# EAGLE design 2021-07-02 OrangeHat (EAGLE 8.6.3)
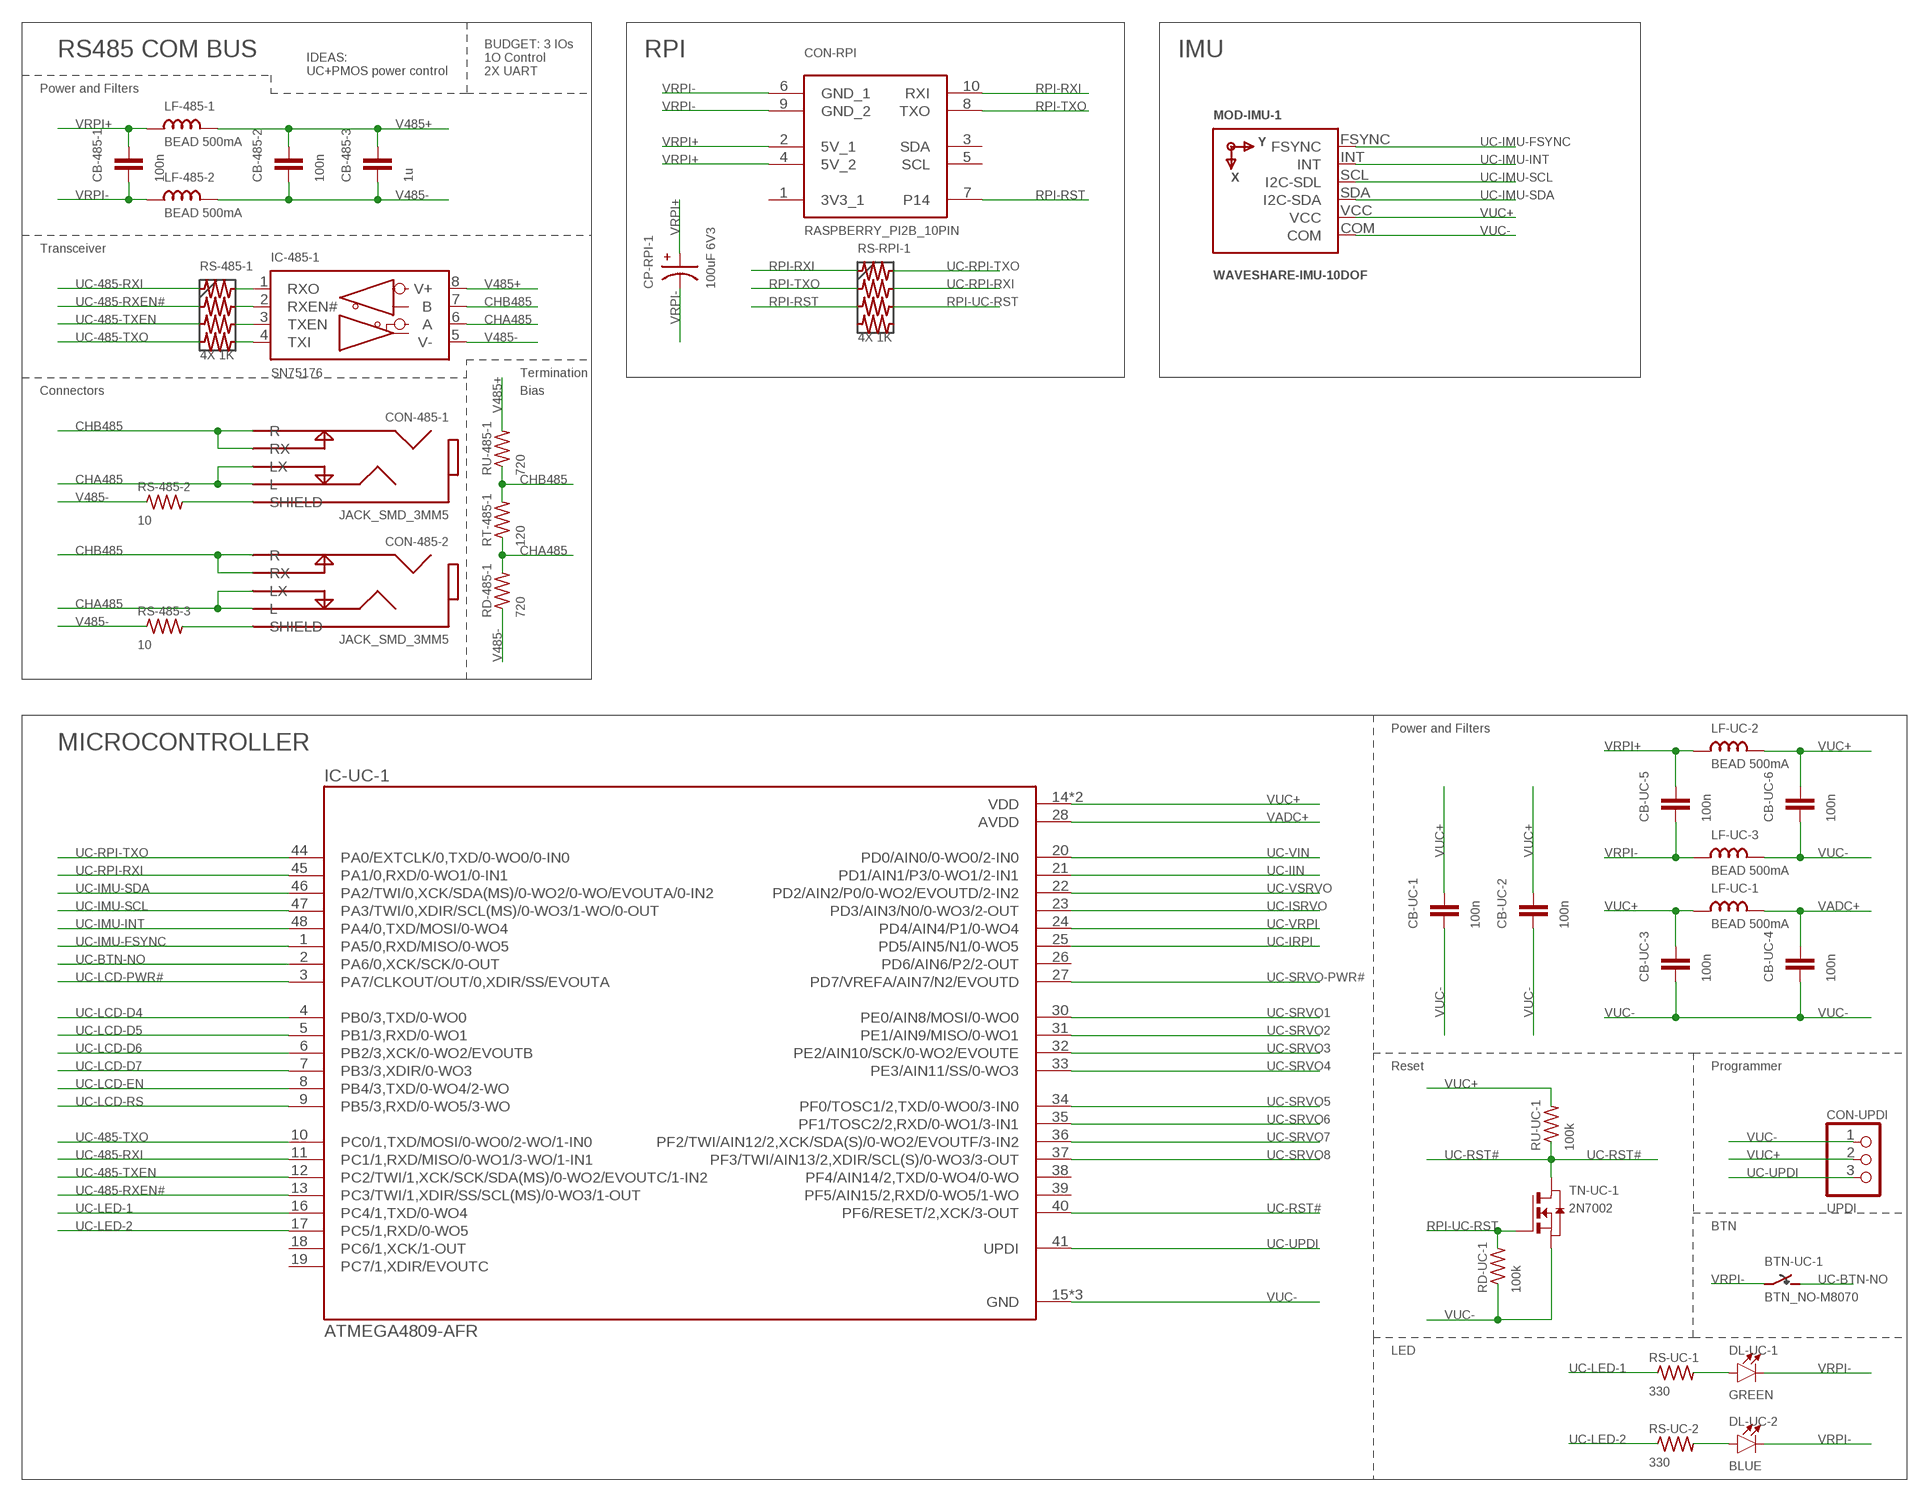
[diagram p0: schematic, sheet 1, part 1 of 2]
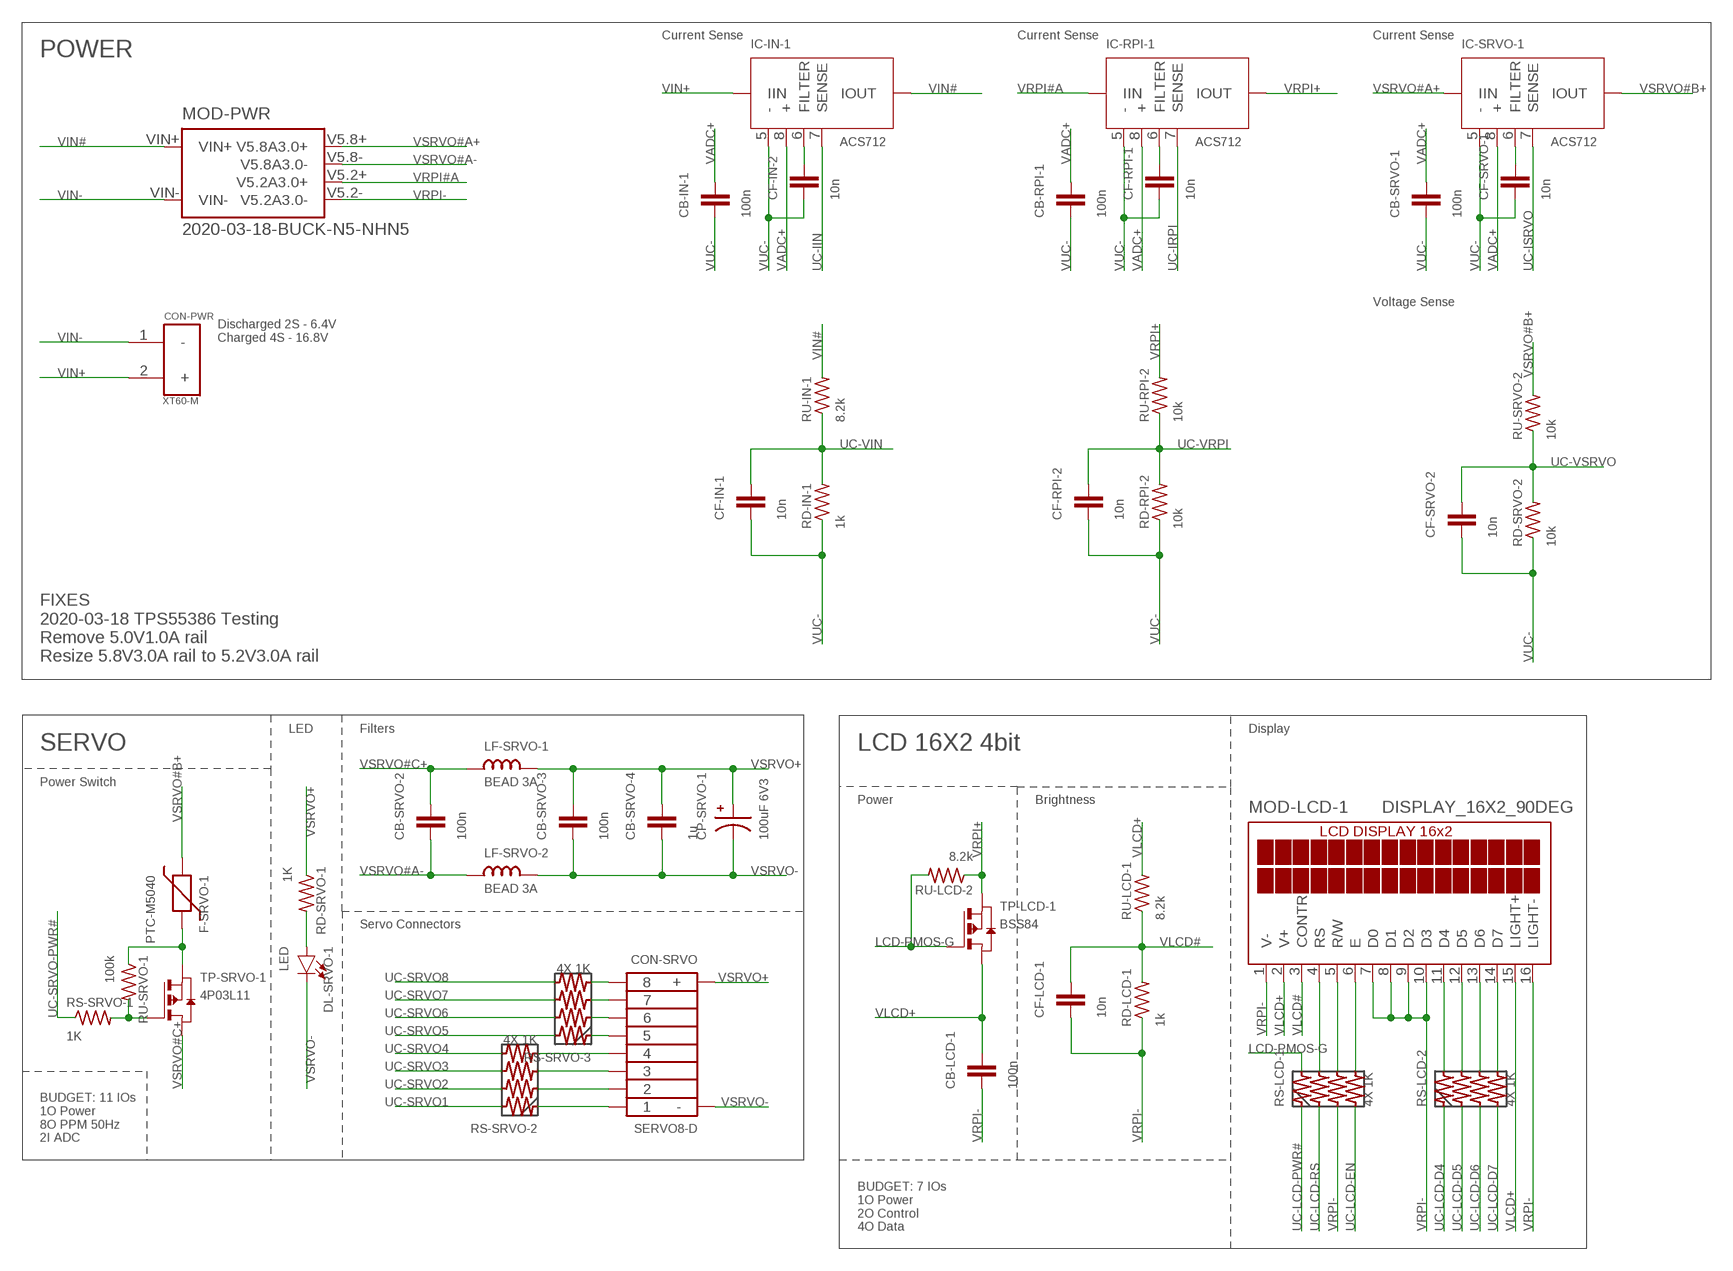
[diagram p1: schematic, sheet 1, part 2 of 2]

## Parts
BTN-UC-1  BTN_NO-M8070  [SMD_BTN_M8070]
CB-485-1  100n  C-NPOL  [SMD-M2012]
CB-485-2  100n  C-NPOL  [SMD-M2012]
CB-485-3  1u  C-NPOL  [SMD-M2012]
CB-IN-1  100n  C-NPOL  [SMD-M2012]
CB-LCD-1  100n  C-NPOL  [SMD-M2012]
CB-RPI-1  100n  C-NPOL  [SMD-M2012]
CB-SRVO-1  100n  C-NPOL  [SMD-M2012]
CB-SRVO-2  100n  C-NPOL  [SMD-M2012]
CB-SRVO-3  100n  C-NPOL  [SMD-M2012]
CB-SRVO-4  1u  C-NPOL  [SMD-M2012]
CB-UC-1  100n  C-NPOL  [SMD-M2012]
CB-UC-2  100n  C-NPOL  [SMD-M2012]
CB-UC-3  100n  C-NPOL  [SMD-M2012]
CB-UC-4  100n  C-NPOL  [SMD-M2012]
CB-UC-5  100n  C-NPOL  [SMD-M2012]
CB-UC-6  100n  C-NPOL  [SMD-M2012]
CF-IN-1  10n  C-NPOL  [SMD-M2012]
CF-IN-2  10n  C-NPOL  [SMD-M2012]
CF-LCD-1  10n  C-NPOL  [SMD-M2012]
CF-RPI-1  10n  C-NPOL  [SMD-M2012]
CF-RPI-2  10n  C-NPOL  [SMD-M2012]
CF-SRVO-1  10n  C-NPOL  [SMD-M2012]
CF-SRVO-2  10n  C-NPOL  [SMD-M2012]
CON-485-1  JACK_SMD_3MM5  [JACK_SMD_3MM5]
CON-485-2  JACK_SMD_3MM5  [JACK_SMD_3MM5]
CON-PWR  XT60-M  [AMASS_XT60-M]
CON-RPI  RASPBERRY_PI2B_10PIN  [RASPBERRY_PI2B_10PIN]
CON-SRVO  SERVO8-D  [SERVO8#]
CON-UPDI  UPDI  PINHD-1X3  [1X03]
CP-RPI-1  100uF 6V3  C-POLE2.5-5  [E2,5-5]
CP-SRVO-1  100uF 6V3  C-POLE2.5-5  [E2,5-5]
DL-SRVO-1  LED  [SMD-M2012-POL]
DL-UC-1  GREEN  LED  [SMD-M2012-POL]
DL-UC-2  BLUE  LED  [SMD-M2012-POL]
F-SRVO-1  PTC-M5040  [SMD-M5040]
IC-485-1  SN75176  RS485  [DIL08]
IC-IN-1  ACS712  [SO8]
IC-RPI-1  ACS712  [SO8]
IC-SRVO-1  ACS712  [SO8]
IC-UC-1  ATMEGA4809-AFR  [QFP50P900X900X120-48N]
LF-485-1  BEAD 500mA  L-M2012  [SMD-M2012]
LF-485-2  BEAD 500mA  L-M2012  [SMD-M2012]
LF-SRVO-1  BEAD 3A  L-M2016  [SMD-M2016]
LF-SRVO-2  BEAD 3A  L-M2016  [SMD-M2016]
LF-UC-1  BEAD 500mA  L-M2012  [SMD-M2012]
LF-UC-2  BEAD 500mA  L-M2012  [SMD-M2012]
LF-UC-3  BEAD 500mA  L-M2012  [SMD-M2012]
MOD-IMU-1  WAVESHARE-IMU-10DOF  [WAVESHARE-IMU-10DOF]
MOD-LCD-1  DISPLAY_16X2_90DEG  [DISPLAY_16X2_90DEG]
MOD-PWR  2020-03-18-BUCK-N5-NHN5  [2020-03-18-BUCK-NHN5]
RD-485-1  720  R0207/2V  [TH-2MM54-V]
RD-IN-1  1k  R-M2012  [SMD-M2012]
RD-LCD-1  1k  R-M2012  [SMD-M2012]
RD-RPI-2  10k  R-M2012  [SMD-M2012]
RD-SRVO-1  1K  R-M2012  [SMD-M2012]
RD-SRVO-2  10k  R-M2012  [SMD-M2012]
RD-UC-1  100k  R-M2012  [SMD-M2012]
RS-485-1  4X 1K  RAC164  [RAC1206]
RS-485-2  10  R-M2012  [SMD-M2012]
RS-485-3  10  R-M2012  [SMD-M2012]
RS-LCD-1  4X 1K  RAC164  [RAC1206]
RS-LCD-2  4X 1K  RAC164  [RAC1206]
RS-RPI-1  4X 1K  RAC164  [RAC1206]
RS-SRVO-1  1K  R-M2012  [SMD-M2012]
RS-SRVO-2  4X 1K  RAC164  [RAC1206]
RS-SRVO-3  4X 1K  RAC164  [RAC1206]
RS-UC-1  330  R-M2012  [SMD-M2012]
RS-UC-2  330  R-M2012  [SMD-M2012]
RT-485-1  120  R0207/2V  [TH-2MM54-V]
RU-485-1  720  R0207/2V  [TH-2MM54-V]
RU-IN-1  8.2k  R-M2012  [SMD-M2012]
RU-LCD-1  8.2k  R-M2012  [SMD-M2012]
RU-LCD-2  8.2k  R-M2012  [SMD-M2012]
RU-RPI-2  10k  R-M2012  [SMD-M2012]
RU-SRVO-1  100k  R-M2012  [SMD-M2012]
RU-SRVO-2  10k  R-M2012  [SMD-M2012]
RU-UC-1  100k  R-M2012  [SMD-M2012]
TN-UC-1  2N7002  MOS-N-SOT23  [SOT23]
TP-LCD-1  BSS84  MOS-P-SOT23  [SOT23]
TP-SRVO-1  4P03L11  MOS-P-TO252  [TO252]

## Nets
CHA485: CON-485-1.L CON-485-1.LX CON-485-2.L CON-485-2.LX IC-485-1.6(A) RD-485-1.2 RT-485-1.1
CHB485: CON-485-1.R CON-485-1.RX CON-485-2.R CON-485-2.RX IC-485-1.7(B) RT-485-1.2 RU-485-1.1
LCD-PMOS-G: RS-LCD-1.1B RU-LCD-2.2 TP-LCD-1.1(G)
N$1: CF-RPI-1.2 IC-RPI-1.6(FILTER)
N$2 [Supply]: CF-IN-2.2 IC-IN-1.6(FILTER)
N$3: MOD-LCD-1.5(R/W) RS-LCD-1.3B
N$4: DL-UC-1.+ RS-UC-1.2
N$5: RS-SRVO-1.2 RU-SRVO-1.2 TP-SRVO-1.1(G)
N$6: F-SRVO-1.2 RU-SRVO-1.1 TP-SRVO-1.2(S)
N$7: MOD-LCD-1.4(RS) RS-LCD-1.2B
N$9: MOD-LCD-1.6(E) RS-LCD-1.4B
N$10: MOD-LCD-1.11(D4) RS-LCD-2.1B
N$11: MOD-LCD-1.12(D5) RS-LCD-2.2B
N$12: MOD-LCD-1.13(D6) RS-LCD-2.3B
N$13: MOD-LCD-1.14(D7) RS-LCD-2.4B
N$15: DL-UC-2.+ RS-UC-2.2
N$19: IC-485-1.1(RXO) RS-485-1.1B
N$20: IC-485-1.2(RXEN#) RS-485-1.2B
N$21: CF-SRVO-1.2 IC-SRVO-1.6(FILTER)
N$22: DL-SRVO-1.+ RD-SRVO-1.2
N$23: CON-SRVO.8 RS-SRVO-3.4A
N$24: CON-SRVO.7 RS-SRVO-3.3A
N$25: CON-SRVO.6 RS-SRVO-3.2A
N$26: CON-SRVO.5 RS-SRVO-3.1A
N$27: CON-SRVO.4 RS-SRVO-2.4A
N$28: CON-SRVO.3 RS-SRVO-2.3A
N$29: CON-SRVO.2 RS-SRVO-2.2A
N$30: CON-SRVO.1 RS-SRVO-2.1A
N$44: IC-485-1.3(TXEN) RS-485-1.3B
N$45: IC-485-1.4(TXI) RS-485-1.4B
N$46: CON-485-1.SHIELD RS-485-2.2
N$47: CON-485-2.SHIELD RS-485-3.2
RPI-RST: CON-RPI.7(P14) RS-RPI-1.3A
RPI-RXI: CON-RPI.10(RXI) RS-RPI-1.1A
RPI-TXO: CON-RPI.8(TXO) RS-RPI-1.2A
RPI-UC-RST: RD-UC-1.2 RS-RPI-1.3B TN-UC-1.1(G)
UC-485-RXEN#: IC-UC-1.13(PC3/TWI/1,XDIR/SS/SCL(MS)/0-WO3/1-OUT) RS-485-1.2A
UC-485-RXI: IC-UC-1.11(PC1/1,RXD/MISO/0-WO1/3-WO/1-IN1) RS-485-1.1A
UC-485-TXEN: IC-UC-1.12(PC2/TWI/1,XCK/SCK/SDA(MS)/0-WO2/EVOUTC/1-IN2) RS-485-1.3A
UC-485-TXO: IC-UC-1.10(PC0/1,TXD/MOSI/0-WO0/2-WO/1-IN0) RS-485-1.4A
UC-BTN-NO: BTN-UC-1.2B BTN-UC-1.3B IC-UC-1.2(PA6/0,XCK/SCK/0-OUT)
UC-IIN: IC-IN-1.7(SENSE) IC-UC-1.21(PD1/AIN1/P3/0-WO1/2-IN1)
UC-IMU-FSYNC: IC-UC-1.1(PA5/0,RXD/MISO/0-WO5) MOD-IMU-1.FSYNC
UC-IMU-INT: IC-UC-1.48(PA4/0,TXD/MOSI/0-WO4) MOD-IMU-1.INT
UC-IMU-SCL: IC-UC-1.47(PA3/TWI/0,XDIR/SCL(MS)/0-WO3/1-WO/0-OUT) MOD-IMU-1.SCL(I2C-SDL)
UC-IMU-SDA: IC-UC-1.46(PA2/TWI/0,XCK/SDA(MS)/0-WO2/0-WO/EVOUTA/0-IN2) MOD-IMU-1.SDA(I2C-SDA)
UC-IRPI: IC-RPI-1.7(SENSE) IC-UC-1.25(PD5/AIN5/N1/0-WO5)
UC-ISRVO: IC-SRVO-1.7(SENSE) IC-UC-1.23(PD3/AIN3/N0/0-WO3/2-OUT)
UC-LCD-D4: IC-UC-1.4(PB0/3,TXD/0-WO0) RS-LCD-2.1A
UC-LCD-D5: IC-UC-1.5(PB1/3,RXD/0-WO1) RS-LCD-2.2A
UC-LCD-D6: IC-UC-1.6(PB2/3,XCK/0-WO2/EVOUTB) RS-LCD-2.3A
UC-LCD-D7: IC-UC-1.7(PB3/3,XDIR/0-WO3) RS-LCD-2.4A
UC-LCD-EN: IC-UC-1.8(PB4/3,TXD/0-WO4/2-WO) RS-LCD-1.4A
UC-LCD-PWR#: IC-UC-1.3(PA7/CLKOUT/OUT/0,XDIR/SS/EVOUTA) RS-LCD-1.1A
UC-LCD-RS: IC-UC-1.9(PB5/3,RXD/0-WO5/3-WO) RS-LCD-1.2A
UC-LED-1: IC-UC-1.16(PC4/1,TXD/0-WO4) RS-UC-1.1
UC-LED-2: IC-UC-1.17(PC5/1,RXD/0-WO5) RS-UC-2.1
UC-RPI-RXI: IC-UC-1.45(PA1/0,RXD/0-WO1/0-IN1) RS-RPI-1.2B
UC-RPI-TXO: IC-UC-1.44(PA0/EXTCLK/0,TXD/0-WO0/0-IN0) RS-RPI-1.1B
UC-RST#: IC-UC-1.40(PF6/RESET/2,XCK/3-OUT) RU-UC-1.1 TN-UC-1.3(D)
UC-SRVO1: IC-UC-1.30(PE0/AIN8/MOSI/0-WO0) RS-SRVO-2.1B
UC-SRVO2: IC-UC-1.31(PE1/AIN9/MISO/0-WO1) RS-SRVO-2.2B
UC-SRVO3: IC-UC-1.32(PE2/AIN10/SCK/0-WO2/EVOUTE) RS-SRVO-2.3B
UC-SRVO4: IC-UC-1.33(PE3/AIN11/SS/0-WO3) RS-SRVO-2.4B
UC-SRVO5: IC-UC-1.34(PF0/TOSC1/2,TXD/0-WO0/3-IN0) RS-SRVO-3.1B
UC-SRVO6: IC-UC-1.35(PF1/TOSC2/2,RXD/0-WO1/3-IN1) RS-SRVO-3.2B
UC-SRVO7: IC-UC-1.36(PF2/TWI/AIN12/2,XCK/SDA(S)/0-WO2/EVOUTF/3-IN2) RS-SRVO-3.3B
UC-SRVO8: IC-UC-1.37(PF3/TWI/AIN13/2,XDIR/SCL(S)/0-WO3/3-OUT) RS-SRVO-3.4B
UC-SRVO-PWR#: IC-UC-1.27(PD7/VREFA/AIN7/N2/EVOUTD) RS-SRVO-1.1
UC-UPDI: CON-UPDI.3 IC-UC-1.41(UPDI)
UC-VIN: CF-IN-1.2 IC-UC-1.20(PD0/AIN0/0-WO0/2-IN0) RD-IN-1.2 RU-IN-1.1
UC-VRPI: CF-RPI-2.2 IC-UC-1.24(PD4/AIN4/P1/0-WO4) RD-RPI-2.2 RU-RPI-2.1
UC-VSRVO: CF-SRVO-2.2 IC-UC-1.22(PD2/AIN2/P0/0-WO2/EVOUTD/2-IN2) RD-SRVO-2.2 RU-SRVO-2.1
V485+ [Supply]: CB-485-2.2 CB-485-3.2 IC-485-1.8(V+) LF-485-1.2 RU-485-1.2
V485- [Supply]: CB-485-2.1 CB-485-3.1 IC-485-1.5(V-) LF-485-2.2 RD-485-1.1 RS-485-2.1 RS-485-3.1
VADC+ [Supply]: CB-IN-1.2 CB-RPI-1.2 CB-SRVO-1.2 CB-UC-4.2 IC-IN-1.8(+) IC-RPI-1.8(+) IC-SRVO-1.8(+) IC-UC-1.28(AVDD) LF-UC-1.2
VIN# [POWER]: IC-IN-1.3(IOUT) IC-IN-1.4(IOUT) MOD-PWR.VIN+ RU-IN-1.2
VIN+ [POWER]: CON-PWR.2(+) IC-IN-1.1(IIN) IC-IN-1.2(IIN)
VIN- [POWER]: CON-PWR.1(-) MOD-PWR.VIN-
VLCD#: CF-LCD-1.2 MOD-LCD-1.3(CONTR) RD-LCD-1.2 RU-LCD-1.1
VLCD+: CB-LCD-1.2 MOD-LCD-1.2(V+) MOD-LCD-1.15(LIGHT+) RU-LCD-1.2 TP-LCD-1.3(D)
VRPI#A: IC-RPI-1.1(IIN) IC-RPI-1.2(IIN) MOD-PWR.V5.2+(V5.2A3.0+)
VRPI+ [POWER]: CB-485-1.2 CB-UC-5.2 CON-RPI.2(5V_1) CON-RPI.4(5V_2) CP-RPI-1.+ IC-RPI-1.3(IOUT) IC-RPI-1.4(IOUT) LF-485-1.1 LF-UC-2.1 RU-LCD-2.1 RU-RPI-2.2 TP-LCD-1.2(S)
VRPI- [POWER]: BTN-UC-1.1A BTN-UC-1.4A CB-485-1.1 CB-LCD-1.1 CB-UC-5.1 CF-LCD-1.1 CON-RPI.6(GND_1) CON-RPI.9(GND_2) CP-RPI-1.- DL-UC-1.- DL-UC-2.- LF-485-2.1 LF-UC-3.1 MOD-LCD-1.1(V-) MOD-LCD-1.7(D0) MOD-LCD-1.8(D1) MOD-LCD-1.9(D2) MOD-LCD-1.10(D3) MOD-LCD-1.16(LIGHT-) MOD-PWR.V5.2-(V5.2A3.0-) RD-LCD-1.1 RS-LCD-1.3A
VSRVO#A+: IC-SRVO-1.1(IIN) IC-SRVO-1.2(IIN) MOD-PWR.V5.8+(V5.8A3.0+)
VSRVO#A- [POWER]: CB-SRVO-2.1 LF-SRVO-2.1 MOD-PWR.V5.8-(V5.8A3.0-)
VSRVO#B+: F-SRVO-1.1 IC-SRVO-1.3(IOUT) IC-SRVO-1.4(IOUT) RU-SRVO-2.2
VSRVO#C+: CB-SRVO-2.2 LF-SRVO-1.1 TP-SRVO-1.3(D)
VSRVO+ [POWER]: CB-SRVO-3.2 CB-SRVO-4.2 CON-SRVO.1+(+) CON-SRVO.2+(+) CON-SRVO.3+(+) CON-SRVO.4+(+) CON-SRVO.5+(+) CON-SRVO.6+(+) CON-SRVO.7+(+) CON-SRVO.8+(+) CP-SRVO-1.+ LF-SRVO-1.2 RD-SRVO-1.1
VSRVO- [POWER]: CB-SRVO-3.1 CB-SRVO-4.1 CON-SRVO.1-(-) CON-SRVO.2-(-) CON-SRVO.3-(-) CON-SRVO.4-(-) CON-SRVO.5-(-) CON-SRVO.6-(-) CON-SRVO.7-(-) CON-SRVO.8-(-) CP-SRVO-1.- DL-SRVO-1.- LF-SRVO-2.2
VUC+ [Supply]: CB-UC-1.2 CB-UC-2.2 CB-UC-3.2 CB-UC-6.2 CON-UPDI.2 IC-UC-1.14(VDD) IC-UC-1.42(VDD) LF-UC-1.1 LF-UC-2.2 MOD-IMU-1.VCC RU-UC-1.2
VUC- [Supply]: CB-IN-1.1 CB-RPI-1.1 CB-SRVO-1.1 CB-UC-1.1 CB-UC-2.1 CB-UC-3.1 CB-UC-4.1 CB-UC-6.1 CF-IN-1.1 CF-IN-2.1 CF-RPI-1.1 CF-RPI-2.1 CF-SRVO-1.1 CF-SRVO-2.1 CON-UPDI.1 IC-IN-1.5(-) IC-RPI-1.5(-) IC-SRVO-1.5(-) IC-UC-1.15(GND) IC-UC-1.29(GND) IC-UC-1.43(GND) LF-UC-3.2 MOD-IMU-1.COM RD-IN-1.1 RD-RPI-2.1 RD-SRVO-2.1 RD-UC-1.1 TN-UC-1.2(S)
Unconnected: CON-RPI.3(SDA) CON-RPI.5(SCL) IC-UC-1.18(PC6/1,XCK/1-OUT) IC-UC-1.19(PC7/1,XDIR/EVOUTC) IC-UC-1.26(PD6/AIN6/P2/2-OUT) IC-UC-1.38(PF4/AIN14/2,TXD/0-WO4/0-WO) IC-UC-1.39(PF5/AIN15/2,RXD/0-WO5/1-WO) RS-RPI-1.4A RS-RPI-1.4B

## Notes on the sheet
- RS485 COM BUS | RPI | IMU
- IDEAS:
  UC+PMOS power control
- BUDGET: 3 IOs
  1O Control
  2X UART
- Power and Filters
- Transceiver
- Termination
- Connectors | Bias
- Power and Filters
- MICROCONTROLLER
- Reset | Programmer
- BTN
- LED
- Current Sense | Current Sense | Current Sense
- POWER
- Voltage Sense
- Discharged 2S - 6.4V
  Charged 4S - 16.8V
- FIXES
  2020-03-18 TPS55386 Testing
  Remove 5.0V1.0A rail
  Resize 5.8V3.0A rail to 5.2V3.0A rail
- LED | Filters | Display
- SERVO | LCD 16X2 4bit
- Power Switch
- Power | Brightness
- Servo Connectors
- BUDGET: 11 IOs
  1O Power
  8O PPM 50Hz
  2I ADC
- BUDGET: 7 IOs
  1O Power
  2O Control
  4O Data

## Power pins joined to a net without a drawn wire
3V3_1: CON-RPI.1(3V3_1)

## Library data of the parts
BTN-UC-1 = 2021-07-02 OrangeHat Library:BTN_NO: Push Button NO (Normally open)
CB-485-1-CB-485-3 CB-IN-1 CB-LCD-1 CB-RPI-1 CB-SRVO-1-CB-SRVO-4 CB-UC-1-CB-UC-6 CF-IN-1 CF-IN-2 CF-LCD-1 CF-RPI-1 CF-RPI-2 CF-SRVO-1 CF-SRVO-2 = 2021-07-02 OrangeHat Library:C-NPOL: CAPACITOR, European symbol
CON-485-1 CON-485-2 = 2021-07-02 OrangeHat Library:JACK_SMD_3MM5: Jack 3.5mm Used to transmit two data channels and 0V reference
CON-PWR = 2021-07-02 OrangeHat Library:XT60-M: DC supply; XT60; male; PIN:2; for cable; soldered; 60A; 500V; AVAILABILITY: Unavailable; MF: AMASS; MP: XT60-M; PACKAGE: Package Analog Devices; PRICE: None
CON-RPI = 2021-07-02 OrangeHat Library:RASPBERRY_PI2B_10PIN: Raspberry Pi 2B/3B Hat Footprint RPI Hat that makes use of 10 pins of the GPIO 2019-10-11: >Updated footprint >Updated GPIO pin numeration
CON-SRVO = 2021-07-02 OrangeHat Library:SERVO8: SERVO Combined servo connector symbol to tidy up schematics
CON-UPDI = 2021-07-02 OrangeHat Library:PINHD-1X3: PIN HEADER
CP-RPI-1 CP-SRVO-1 = 2021-07-02 OrangeHat Library:C-POL: POLARIZED CAPACITOR, American symbol
DL-SRVO-1 DL-UC-1 DL-UC-2 = 2021-07-02 OrangeHat Library:LED: Standard LED SMD0805 Polarized Package
F-SRVO-1 = 2021-07-02 OrangeHat Library:PTC: Resettable Fuse PTC Resettable Fuse. Spark Fun Electronics SKU : COM-08357
IC-485-1 = 2021-07-02 OrangeHat Library:RS485: RS485 TRANSEIVER; MPN: MAX481CPA+; OC_FARNELL: unknown; OC_NEWARK: 99K3445
IC-IN-1 IC-RPI-1 IC-SRVO-1 = 2021-07-02 OrangeHat Library:ACS712: ACS712-{X} Hall effect current sensor {X} = current rating
IC-UC-1 = 2021-07-02 OrangeHat Library:ATMEGA4809-AFR: 20MHz 48KB TQFP48 Ind 125C Green T&R; AVAILABILITY: Unavailable; DESCRIPTION: 20MHz 48KB TQFP48 Ind 125C Green T&R; MF: Microchip; MP: ATMEGA4809-AFR; PACKAGE: TQFP-48 Microchip; PRICE: None
LF-485-1 LF-485-2 LF-SRVO-1 LF-SRVO-2 LF-UC-1-LF-UC-3 = 2021-07-02 OrangeHat Library:L: INDUCTOR, American symbol
MOD-IMU-1 = 2021-07-02 OrangeHat Library:WAVESHARE-IMU-10DOF: WaveShare IMU 10DOF Dimensions: 31x16mm Pins: 6x2.54mm Link: https://www.waveshare.com/10-dof-imu-sensor-b.html
MOD-LCD-1 = 2021-07-02 OrangeHat Library:DISPLAY_16X2_90DEG: Display 16X2 90° mounting 16pin 2.54mm spacing
MOD-PWR = 2021-07-02 OrangeHat Library:2020-03-18-BUCK-N5: 2020-03-18 Buck Module Output 1: 5.8V3.0A SW Output 2:5.2V 3.0A SW Output 3: 5.0V 1.0A LDO
RD-485-1 RD-IN-1 RD-LCD-1 RD-RPI-2 RD-SRVO-1 RD-SRVO-2 RD-UC-1 RS-485-2 RS-485-3 RS-SRVO-1 RS-UC-1 RS-UC-2 RT-485-1 RU-485-1 RU-IN-1 RU-LCD-1 RU-LCD-2 RU-RPI-2 RU-SRVO-1 RU-SRVO-2 RU-UC-1 = 2021-07-02 OrangeHat Library:R: RESISTOR, American symbol
RS-485-1 RS-LCD-1 RS-LCD-2 RS-RPI-1 RS-SRVO-2 RS-SRVO-3 = 2021-07-02 OrangeHat Library:RAC164: Resistor Array of four elements
TN-UC-1 = 2021-07-02 OrangeHat Library:MOS-N: Standard NMOS
TP-LCD-1 TP-SRVO-1 = 2021-07-02 OrangeHat Library:MOS-P: MOS-P SOT23

## Net classes
0 Signal: width 0.16 mm, drill 0.25 mm, clearance 0.16 mm
1 Supply: width 0.2 mm, drill 0.35 mm, clearance 0.19 mm
2 POWER: width 0.5 mm, drill 0.5 mm, clearance 0.29 mm

## Board
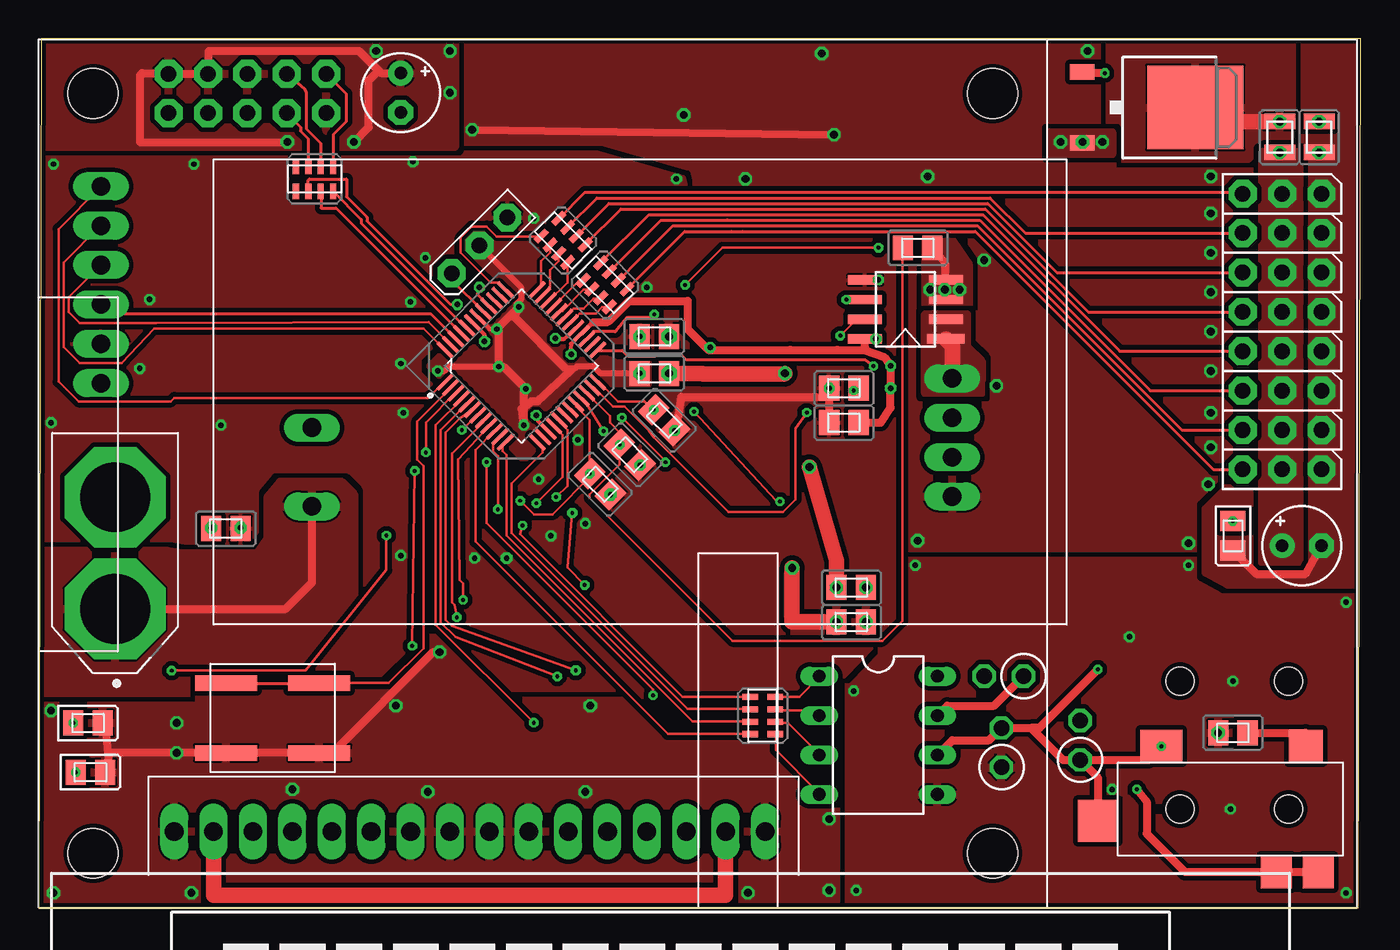
[diagram p2: board, top side]
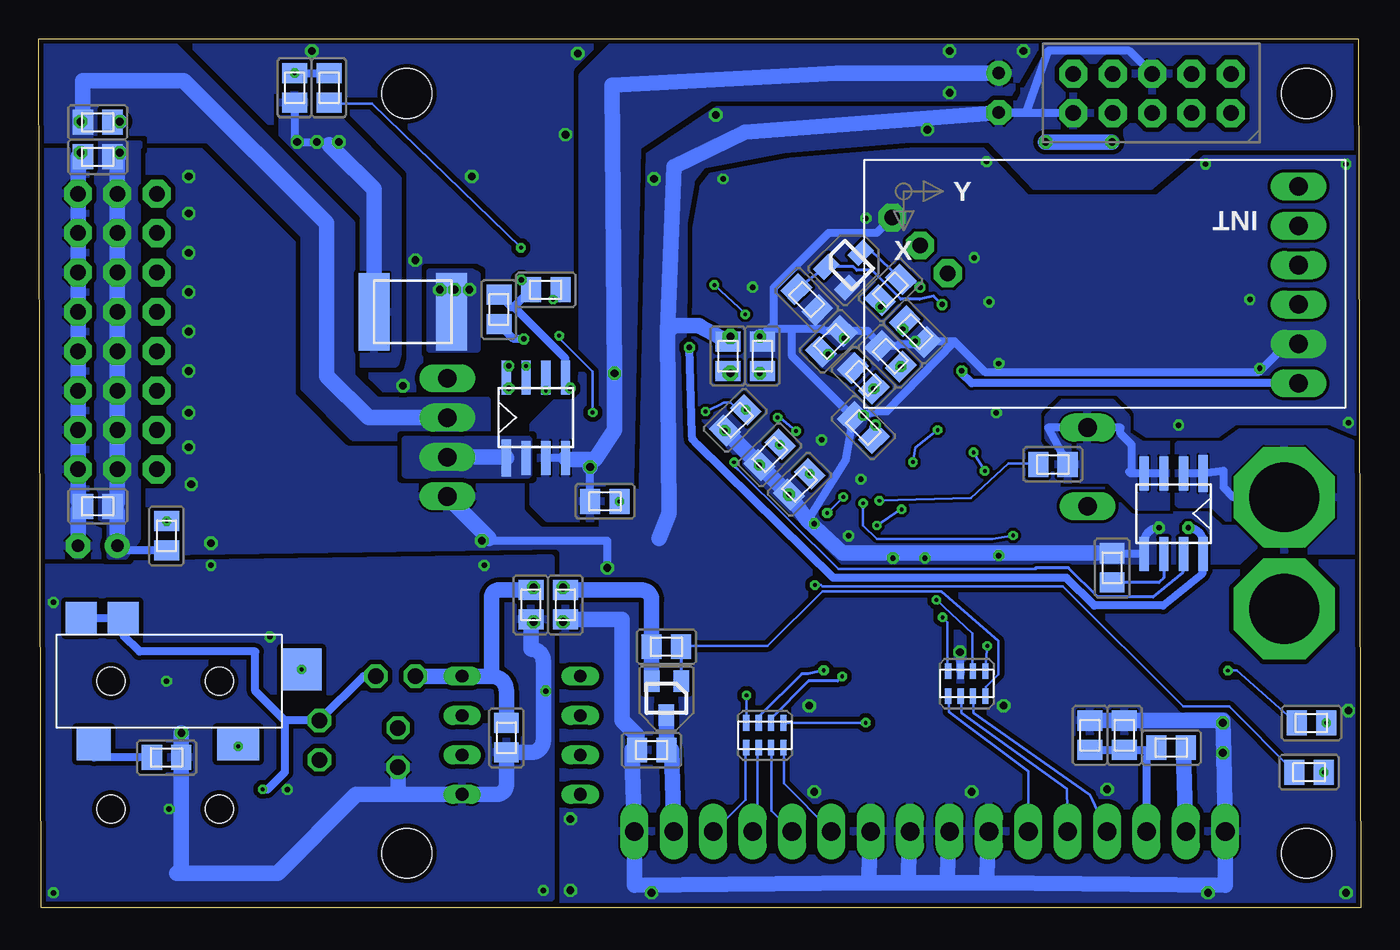
[diagram p3: board, bottom side, seen from below]

Size 85.24 x 56.03 mm. Coordinates in mm from the lower left corner, seen from the top.
Outline: 0,0 85.08,0 85.24,56.03 0.16,56.03 0,0
Copper layers (1*16): Top 0.035mm / dielectric 1.5mm / Bottom 0.035mm
Design rules "default *": minimum track width 0.15mm, minimum drill 0.25mm, track to track 0.15mm, track to pad 0.15mm, pad to pad 0.15mm, via to via 0.15mm, smd to smd 0.15mm, copper to edge 0.15mm, drill to drill 6mil, minimum pad ring 0.175mm, minimum via ring 0.175mm, stop-mask expansion 0.1mm, vias tented up to drill 0mil, thermal gap 0.13mm

### Footprints (pad centres in the part's own frame; a part is rotated, then mirrored left to right if it is on the bottom)
SMD_BTN_M8070 = smd 4 x 1: 1A -3,2.25; 2B -3,-2.25; 3B 3,-2.25; 4A 3,2.25
SMD-M2012 = smd 1.3 x 1.6: 1 -0.95,0; 2 0.95,0
JACK_SMD_3MM5 = smd 2.7 x 2.1: L 4.45,-4.05 | smd 2.6 x 2.7: LX 8.55,0.75 | smd 2 x 2.1: R -2.95,4.05; RX -5.65,4.05 | smd 2.2 x 2.1: SHIELD -4.85,-4.05 | hole 1.8: -3.75,0; 3.25,0
AMASS_XT60-M = drill 4.5 pad 6 octagon: 1 -3.6,0; 2 3.6,0
RASPBERRY_PI2B_10PIN = drill 1 pad 1.8 octagon: 1 8.37,51.23; 2 8.37,53.77; 3 10.91,51.23; 4 10.91,53.77; 5 13.45,51.23; 6 13.45,53.77; 7 15.99,51.23; 8 15.99,53.77; 9 18.53,51.23; 10 18.53,53.77 | hole 3.2: 3.5,3.5; 3.5,52.5; 61.5,52.5; 61.5,3.5
SERVO8# = drill 1 pad 1.8 octagon: 1 5.08,17.78; 1+ 2.54,17.78; 1- 0,17.78; 2 5.08,15.24; 2+ 2.54,15.24; 2- 0,15.24; 3 5.08,12.7; 3+ 2.54,12.7; 3- 0,12.7; 4 5.08,10.16; 4+ 2.54,10.16; 4- 0,10.16; 5 5.08,7.62; 5+ 2.54,7.62; 5- 0,7.62; 6 5.08,5.08; 6+ 2.54,5.08; 6- 0,5.08; 7 5.08,2.54; 7+ 2.54,2.54; 7- 0,2.54; 8 5.08,0; 8+ 2.54,0; 8- 0,0
1X03 = drill 1 pad 1.8 octagon: 1 -2.54,0; 2 0,0; 3 2.54,0
E2,5-5 = drill 0.813 pad 1.6: + -1.27,0 | drill 0.813 pad 1.6 octagon: - 1.27,0
SMD-M2012-POL = smd 1.3 x 1.6: + 0.95,0; - -0.95,0
SMD-M5040 = smd 2 x 5: 1 -2.5,0; 2 2.5,0
DIL08 = drill 0.813 long: 1 -3.81,-3.81; 2 -1.27,-3.81; 3 1.27,-3.81; 4 3.81,-3.81; 5 3.81,3.81; 6 1.27,3.81; 7 -1.27,3.81; 8 -3.81,3.81
SO8 = smd 0.6 x 2.4: 1 -1.905,-2.6 | smd 0.6 x 2.2: 2 -0.635,-2.6; 3 0.635,-2.6; 4 1.905,-2.6; 5 1.905,2.6; 6 0.635,2.6; 7 -0.635,2.6; 8 -1.905,2.6
QFP50P900X900X120-48N = smd 1.47 x 0.28: 1 -4.17,2.75; 2 -4.17,2.25; 3 -4.17,1.75; 4 -4.17,1.25; 5 -4.17,0.75; 6 -4.17,0.25; 7 -4.17,-0.25; 8 -4.17,-0.75; 9 -4.17,-1.25; 10 -4.17,-1.75; 11 -4.17,-2.25; 12 -4.17,-2.75; 25 4.17,-2.75; 26 4.17,-2.25; 27 4.17,-1.75; 28 4.17,-1.25; 29 4.17,-0.75; 30 4.17,-0.25; 31 4.17,0.25; 32 4.17,0.75; 33 4.17,1.25; 34 4.17,1.75; 35 4.17,2.25; 36 4.17,2.75 | smd 0.28 x 1.47: 13 -2.75,-4.17; 14 -2.25,-4.17; 15 -1.75,-4.17; 16 -1.25,-4.17; 17 -0.75,-4.17; 18 -0.25,-4.17; 19 0.25,-4.17; 20 0.75,-4.17; 21 1.25,-4.17; 22 1.75,-4.17; 23 2.25,-4.17; 24 2.75,-4.17; 37 2.75,4.17; 38 2.25,4.17; 39 1.75,4.17; 40 1.25,4.17; 41 0.75,4.17; 42 0.25,4.17; 43 -0.25,4.17; 44 -0.75,4.17; 45 -1.25,4.17; 46 -1.75,4.17; 47 -2.25,4.17; 48 -2.75,4.17
SMD-M2016 = smd 1 x 2: 1 -1,0; 2 1,0
WAVESHARE-IMU-10DOF = drill 1.2 long: COM 28,4.128; FSYNC 28,14.287; INT 28,11.748; SCL 28,9.207; SDA 28,6.668; VCC 28,1.587
DISPLAY_16X2_90DEG = drill 1.2 long: 1 8.005,14.23; 2 10.545,14.23; 3 13.085,14.23; 4 15.625,14.23; 5 18.165,14.23; 6 20.705,14.23; 7 23.245,14.23; 8 25.785,14.23; 9 28.325,14.23; 10 30.865,14.23; 11 33.405,14.23; 12 35.945,14.23; 13 38.485,14.23; 14 41.025,14.23; 15 43.565,14.23; 16 46.105,14.23
2020-03-18-BUCK-NHN5 = drill 1.2 long: V5.2+ 47.625,10.795; V5.2- 47.625,8.255; V5.8+ 47.625,15.875; V5.8- 47.625,13.335; VIN+ 6.35,12.7; VIN- 6.35,7.62
TH-2MM54-V = drill 1 octagon: 1 -1.27,0; 2 1.27,0
RAC1206 = smd 0.4 x 1: 1A -1.2,-0.8; 1B -1.2,0.8; 2A -0.4,-0.8; 2B -0.4,0.8; 3A 0.4,-0.8; 3B 0.4,0.8; 4A 1.2,-0.8; 4B 1.2,0.8
SOT23 = smd 1 x 1.4: 1 -0.95,-1.1; 2 0.95,-1.1; 3 0,1.1
TO252 = smd 1 x 1.6: 1 -2.28,-4.8; 2 2.28,-4.8 | smd 5.4 x 6.2: 3 0,2.5

### Placement (x,y rotation side)
BTN-UC-1  15.08,12.22 180 top
CB-485-1  51.28,19.53 90 bottom
CB-485-2  53.5,19.53 90 bottom
CB-485-3  55.09,10.95 90 bottom
CB-IN-1  12.06,24.45 180 top
CB-LCD-1  45.72,10.16 0 bottom
CB-RPI-1  51.91,31.27 0 top
CB-SRVO-1  55.56,38.58 270 bottom
CB-SRVO-2  81.44,50.64 0 bottom
CB-SRVO-3  81.44,48.42 0 bottom
CB-SRVO-4  81.44,25.88 0 bottom
CB-UC-1  32.07,30.96 315 bottom
CB-UC-2  28.73,37.15 135 bottom
CB-UC-3  30.32,35.56 315 bottom
CB-UC-4  34.13,36.51 225 bottom
CB-UC-5  40.8,35.56 270 bottom
CB-UC-6  38.58,35.56 270 bottom
CF-IN-1  36.2,27.3 45 bottom
CF-IN-2  16.03,21.91 270 bottom
CF-LCD-1  17.46,11.11 270 bottom
CF-RPI-1  51.91,33.5 0 top
CF-RPI-2  40.32,31.43 45 bottom
CF-SRVO-1  52.55,39.85 0 bottom
CF-SRVO-2  38.1,29.21 45 bottom
CON-485-1  76.83,14.61 0 bottom
CON-485-2  76.83,6.35 180 top
CON-PWR  4.92,22.86 90 top
CON-RPI  0,0 0 top
CON-SRVO  82.71,46.04 180 top
CON-UPDI  28.42,42.7 225 top
CP-RPI-1  23.34,52.55 270 top
CP-SRVO-1  81.44,23.34 0 top
DL-SRVO-1  76.99,23.97 90 top
DL-UC-1  3.17,11.91 180 top
DL-UC-2  3.33,8.73 180 top
F-SRVO-1  61.12,38.42 180 bottom
IC-485-1  54.13,11.11 270 top
IC-IN-1  12.06,25.4 180 bottom
IC-RPI-1  53.18,31.59 0 bottom
IC-SRVO-1  55.88,38.58 90 top
IC-UC-1  31.11,34.92 45 top
LF-485-1  52.39,20.64 0 top
LF-485-2  52.39,18.41 0 top
LF-SRVO-1  80.01,49.69 270 top
LF-SRVO-2  82.55,49.69 270 top
LF-UC-1  32.07,34.13 135 bottom
LF-UC-2  39.69,34.45 180 top
LF-UC-3  39.69,36.83 180 top
MOD-IMU-1  32.01,32.23 0 bottom
MOD-LCD-1  0.73,-9.32 0 top
MOD-PWR  11.27,18.26 0 top
RD-485-1  62.07,10.32 90 top
RD-IN-1  36.2,27.3 135 top
RD-LCD-1  15.24,11.11 270 bottom
RD-RPI-2  40.32,31.43 135 top
RD-SRVO-1  76.99,23.97 90 bottom
RD-SRVO-2  38.1,29.21 135 top
RD-UC-1  35.72,39.21 135 bottom
RS-485-1  46.67,12.38 270 top
RS-485-2  76.99,9.68 180 bottom
RS-485-3  76.99,11.27 0 top
RS-LCD-1  25.4,14.45 180 bottom
RS-LCD-2  38.42,11.11 180 bottom
RS-RPI-1  17.78,46.99 180 top
RS-SRVO-1  66.52,52.86 90 bottom
RS-SRVO-2  36.51,40.16 135 top
RS-SRVO-3  33.81,43.02 135 top
RS-UC-1  3.17,11.91 0 bottom
RS-UC-2  3.33,8.73 0 bottom
RT-485-1  67.15,10.79 90 top
RU-485-1  62.23,14.92 180 top
RU-IN-1  19.84,28.57 0 bottom
RU-LCD-1  12.22,10.32 0 bottom
RU-LCD-2  44.77,16.83 0 bottom
RU-RPI-2  48.74,26.19 180 bottom
RU-SRVO-1  68.74,52.86 90 bottom
RU-SRVO-2  56.67,42.55 0 top
RU-UC-1  30.32,39.85 225 bottom
TN-UC-1  33.02,41.43 315 bottom
TP-LCD-1  44.77,13.51 180 bottom
TP-SRVO-1  72.07,51.59 270 top
U$1  [SIGNATURE_ADROBOT_SMALL]  27.78,52.7 0 top
U$2  [SIGNATURE_ORANGEBOT_SMALL]  31.59,53.98 0 top

### Tracks (layer width: path | path; a pad name or v marks a point on that pad's centre or on a via)
CHA485  (via drill 0.25 pad 0.6)
  Top 0.5: IC-485-1.6 58.9,10.79 61.28,10.79 RD-485-1.2 63.98,11.59 | RT-485-1.1 66.04,9.53 63.98,11.59 | RT-485-1.1 68.28,8.39 CON-485-2.LX | RT-485-1.1 71.51,9.53 v72.39,10.4 | CON-485-1.LX 64.52,11.59 63.98,11.59
  Bottom 0.2: CON-485-1.L v72.39,10.4
  other vias: 68.28,15.36
CHB485  (via drill 0.25 pad 0.6)
  Top 0.5: IC-485-1.7 58.58,13.02 61.59,13.02 RU-485-1.1 | v70.8,7.62 71.44,6.83 71.44,4.76 73.9,2.3 CON-485-2.R CON-485-2.RX
  Bottom 0.5: RU-485-1.1 64.29,14.92 RT-485-1.2 69.37,12.06 | 69.37,12.06 71.28,13.97 71.28,16.51 78.74,16.51 79.78,17.55 CON-485-1.R CON-485-1.RX | 69.37,12.06 69.37,8.73 70.48,7.62 v70.8,7.62
LCD-PMOS-G
  Bottom 0.16: RS-LCD-1.1B 24.16,13.68 24.16,14.24 23.36,15.04 23.36,17.2 27.04,20.4 34.72,20.4 38.24,16.88 43.76,16.88 RU-LCD-2.2
  Bottom 0.2: RU-LCD-2.2 TP-LCD-1.1
N$1  (via drill 0.25 pad 0.6)
  Top 0.2: v52.55,33.34 52.7,33.34 CF-RPI-1.2
  Bottom 0.2: IC-RPI-1.6 v52.55,33.34
N$2
  Bottom 0.2: IC-IN-1.6 12.7,21.27 13.02,20.96 CF-IN-2.2
N$3
  Bottom 0.16: RS-LCD-1.3B 25.76,13.6 25.76,12.55 18.96,7.66 MOD-LCD-1.5
N$4  (via drill 0.25 pad 0.6)
  other vias: 2.23,11.91
N$5  (via drill 0.25 pad 0.6)
  Top 0.5: RU-SRVO-1.2 67.33,53.81 TP-SRVO-1.1
  Bottom 0.5: RU-SRVO-1.2 RS-SRVO-1.2
  other vias: 68.74,53.81
N$6  (via drill 0.5 pad 0.8)
  Bottom 0.5: RU-SRVO-1.1 68.74,49.53 v68.58,49.37 v67.31,49.37 v65.88,49.37 66.12,49.13 66.12,48.82
  Bottom 1: F-SRVO-1.2 63.62,46.31 66.12,48.82 66.52,49.21
  pour Top (isolate 0.3, no thermals): 65.25,50.01 69.22,50.01 69.22,48.58 65.25,48.58
  pour Bottom (isolate 0.3, rank 3): 65.09,35.08 62.23,35.08 62.07,35.72 62.07,46.99 65.88,50.8 68.1,50.8 68.1,52.39 69.53,52.39 69.53,48.9 69.06,47.62 64.29,44.29 64.29,36.51 65.09,35.72
N$7
  Bottom 0.16: RS-LCD-1.2B 24.96,13.6 24.96,12.57 17.45,7.28 17.29,6.96 16.4,4.96 MOD-LCD-1.4
N$9
  Bottom 0.16: RS-LCD-1.4B 26.56,13.6 26.56,12.62 21.44,8.77 21.44,4.96 MOD-LCD-1.6
N$10
  Bottom 0.16: RS-LCD-2.1B 37.2,10.24 37.2,8 34.16,4.96 MOD-LCD-1.11
N$11
  Bottom 0.16: RS-LCD-2.2B 38,10.24 38,6.24 36.72,4.96 MOD-LCD-1.12
N$12
  Bottom 0.16: RS-LCD-2.3B 38.88,10.24 38.88,5.28 39.2,4.96 MOD-LCD-1.13
N$13
  Bottom 0.16: RS-LCD-2.4B 39.68,10.24 39.68,6.96 41.68,4.96 MOD-LCD-1.14
N$15  (via drill 0.25 pad 0.6)
  other vias: 2.38,8.73
N$19
  Top 0.16: RS-485-1.1B 47.52,13.6 49.04,13.6 50.32,14.88 IC-485-1.1
N$20
  Top 0.16: RS-485-1.2B 47.52,12.72 50,12.72 50.32,12.4 IC-485-1.2
N$21  (via drill 0.25 pad 0.6)
  Top 0.2: v52.07,39.21 IC-SRVO-1.6
  Bottom 0.2: CF-SRVO-1.2 51.6,39.53 51.91,39.21 v52.07,39.21
N$22  (via drill 0.25 pad 0.6)
  other vias: 76.99,24.92
N$23
  Top 0.2: RS-SRVO-3.4A 35.22,46.12 77.54,46.12 CON-SRVO.8
N$24
  Top 0.2: RS-SRVO-3.3A 35.99,45.77 61.33,45.77 63.6,43.5 CON-SRVO.7
N$25
  Top 0.2: RS-SRVO-3.2A 36.76,45.41 61.18,45.41 65.63,40.96 CON-SRVO.6
N$26
  Top 0.2: RS-SRVO-3.1A 37.53,45.05 61.03,45.05 67.66,38.42 CON-SRVO.5
N$27
  Top 0.2: RS-SRVO-2.4A 39.34,44.69 60.88,44.69 69.69,35.88 CON-SRVO.4
N$28
  Top 0.2: 44.45,44.33 60.67,44.33 71.66,33.34 CON-SRVO.3 | 44.34,44.33 40.11,44.33 RS-SRVO-2.3A | 44.34,44.33 44.45,44.33 | 44.45,44.33 | 44.45,44.33 44.34,44.33
N$29
  Top 0.2: RS-SRVO-2.2A 38.78,41.86 38.87,41.95 40.88,43.97 44.49,43.97 45.09,43.97 60.52,43.97 73.69,30.8 CON-SRVO.2
N$30
  Top 0.2: CON-SRVO.1 75.72,28.26 60.38,43.6 45.4,43.6 44.64,43.6 41.65,43.6 RS-SRVO-2.1A
N$44
  Top 0.16: RS-485-1.3B 47.52,11.92 48.32,11.92 50.32,9.92 IC-485-1.3
N$45
  Top 0.16: RS-485-1.4B 47.52,11.12 47.52,10.16 50.32,7.36 IC-485-1.4
N$46
  Bottom 0.5: RS-485-2.2 81.69,9.68 CON-485-1.SHIELD
N$47
  Top 0.5: RS-485-3.2 81.69,11.27 CON-485-2.SHIELD
RPI-RST
  Top 0.2: CON-RPI.7 16.88,50.34 16.88,50.08 17.38,49.58 RS-RPI-1.3A
RPI-RXI
  Top 0.2: RS-RPI-1.1A 18.98,49.86 19.82,50.7 19.82,52.48 CON-RPI.10
RPI-TXO
  Top 0.2: CON-RPI.8 17.14,52.77 17.14,52.78 17.24,52.56 17.24,50.23 18.18,49.29 RS-RPI-1.2A
RPI-UC-RST  (via drill 0.35)
  Top 0.2: RS-RPI-1.3B 17.38,46.91 17.46,46.99 19.84,46.99 19.84,45.84 21.16,44.52 21.16,44.28 26.53,38.91 v26.99,38.89
  Bottom 0.2: RD-UC-1.2 TN-UC-1.1 32.72,41.33 32.49,41.1 31.52,41.1 29.65,39.23 28.44,39.23 27.54,39.45 27.55,39.45 v26.99,38.89
UC-485-RXEN#
  Top 0.16: RS-485-1.2A 45.84,12.8 41.84,12.8 30.48,24.16 30.48,27.36 32.48,29.36 32.48,29.68 32.16,30 IC-UC-1.13
UC-485-RXI  (via drill 0.25 pad 0.6)
  Top 0.16: v31.2,24.64 31.04,24.08 41.52,13.6 45.84,13.6 RS-485-1.1A | v29.6,25.68 29.6,29.12 29.28,29.44 29.28,29.92 29.68,30.32 IC-UC-1.11
  Bottom 0.16: v31.2,24.64 29.68,25.68 v29.6,25.68
UC-485-TXEN
  Top 0.16: RS-485-1.3A 45.84,12 42.16,12 30.16,24 30.16,29.2 29.92,29.44 29.92,29.84 30.08,30 IC-UC-1.12
UC-485-TXO
  Top 0.16: RS-485-1.4A 45.84,11.2 40.56,11.2 28.16,23.6 28.16,29.52 29.36,30.72 IC-UC-1.10
UC-BTN-NO
  Top 0.16: IC-UC-1.2 26.56,33.52 24.4,31.36 24.4,28.88 24.8,28.48 24.8,16.72 22.56,14.48 18.16,14.48 BTN-UC-1.2B
  Top 0.2: BTN-UC-1.3B BTN-UC-1.2B
UC-IIN  (via drill 0.25 pad 0.6)
  Top 0.16: v36.4,30.72 35.12,32.8 34.96,32.8 IC-UC-1.21 | v37.6,31.6 40.24,28.96 v40.4,28.72
  Bottom 0.16: v36.4,30.72 37.02,31.24 37.44,31.6 v37.6,31.6 | v40.4,28.72 40.4,28.49 40.16,28.26 33.68,21.84 20.96,21.84 20.95,21.91
  Bottom 0.2: IC-IN-1.7 11.47,22.44 11.47,21.63 13.4,20.02 16.95,20.02 18.84,21.91 20.95,21.91
UC-IMU-FSYNC
  Top 0.16: IC-UC-1.1 26.16,33.92 25.2,32.96 25.08,32.86 8.73,32.86 8.51,32.64 2.56,32.64 1.28,33.92 1.28,43.76 4,46.48 MOD-IMU-1.FSYNC
UC-IMU-INT
  Top 0.16: IC-UC-1.48 26.16,36 24.81,37.35 7.43,37.35 5.36,35.12 2.64,35.12 1.6,36.16 1.6,41.6 4,44 MOD-IMU-1.INT
UC-IMU-SCL
  Top 0.16: IC-UC-1.47 26.56,36.32 25.13,37.75 7.58,37.68 2.64,37.68 1.92,38.4 1.92,39.36 MOD-IMU-1.SCL
UC-IMU-SDA
  Top 0.16: 26.88,36.64 IC-UC-1.46
  Top 0.2: IC-UC-1.46 25.31,38.26 4.64,38.26 MOD-IMU-1.SDA
UC-IRPI  (via drill 0.25 pad 0.6)
  Top 0.19: v53.82,34.92 v53.81,34.92 53.24,35.34 41.75,35.34 41.45,35.63 39.83,35.63 39.78,35.58 39.51,35.58
  Top 0.2: 39.53,35.56 39.51,35.58 37.97,35.58 37.62,35.93 IC-UC-1.25
  Bottom 0.19: v53.82,34.92 53.98,34.77 53.82,34.61 IC-RPI-1.7
UC-ISRVO  (via drill 0.25 pad 0.6)
  Top 0.16: v49.52,31.93 48.8,30.89 48.8,26.32 48,25.52 44.48,25.52 39.68,30.32 39.36,30.72 37.76,32.32 37.04,32.32 35.84,33.52 35.68,33.52 IC-UC-1.23 | v51.68,36.88 52.72,37.92 53.28,37.92 IC-SRVO-1.7
  Bottom 0.16: v49.52,31.93 49.52,34.56 51.68,36.72 v51.68,36.88
UC-LCD-D4  (via drill 0.25 pad 0.6)
  Top 0.16: v31.92,11.92 25.6,18.24 25.6,31.12 27.28,32.8 IC-UC-1.4
  Bottom 0.16: v31.92,11.92 37.2,11.92 RS-LCD-2.1A
UC-LCD-D5  (via drill 0.25)
  Top 0.16: v33.44,14.9 26.88,17.44 25.92,18.4 25.92,30.8 27.6,32.48 IC-UC-1.5
  Bottom 0.16: 38,12.24 38,11.92 RS-LCD-2.2A
  Bottom 0.2: v33.44,14.9 33.73,14.61 35.59,14.61 38.02,12.18 RS-LCD-2.2A
UC-LCD-D6  (via drill 0.25 pad 0.65)
  Top 0.16: v34.63,15.3 26.64,18.16 26.24,18.56 26.24,30.64 27.13,31.52 IC-UC-1.6
  Bottom 0.16: 38.8,12.24 38.8,11.92 RS-LCD-2.3A
  Bottom 0.2: v34.63,15.3 35.64,15.08 36.04,15.08 38.8,12.32 38.8,12.24
UC-LCD-D7  (via drill 0.25 pad 0.6)
  Top 0.16: v39.6,13.68 39.6,14.08 28.88,24.8 v28.88,28.73 | v27.28,30.8 28.32,31.84 IC-UC-1.7
  Bottom 0.16: v39.6,13.68 39.6,11.92 RS-LCD-2.4A | v28.88,28.73 28.72,29.68 v27.28,30.8
UC-LCD-EN  (via drill 0.25)
  Top 0.16: v26.96,18.72 26.8,19.52 26.64,19.68 26.64,29.28 28.64,31.28 IC-UC-1.8
  Bottom 0.16: v26.96,18.72 26.64,18.4 26.64,15.28 RS-LCD-1.4A
UC-LCD-PWR#  (via drill 0.25 pad 0.6)
  Top 0.16: v24.24,28.16 v24.08,16.88 | v24.96,29.36 24.96,31.28 26.88,33.2 IC-UC-1.3
  Bottom 0.16: v24.08,16.88 24.24,15.28 RS-LCD-1.1A | v24.96,29.36 v24.24,28.16
UC-LCD-RS  (via drill 0.25)
  Top 0.16: v27.36,19.84 27.36,20.9 27.15,21.11 27.04,28.88 29.04,31.04 IC-UC-1.9
  Bottom 0.16: v27.36,19.84 25.04,17.68 25.04,15.28 RS-LCD-1.2A
UC-LED-1  (via drill 0.25 pad 0.6)
  Top 0.16: v32.08,26.08 33.76,27.76 33.76,30.48 33.2,31.04 IC-UC-1.16 | v22.41,24 22.41,21.76 17.2,15.28 v8.56,15.28
  Bottom 0.16: v32.08,26.08 32.08,24.64 31.2,23.76 23.76,23.76 v22.41,24 | v8.56,15.28 8,15.28 4.16,11.92 RS-UC-1.1
UC-LED-2  (via drill 0.25 pad 0.6, 0.25 pad 0.65)
  Top 0.16: v33.36,26.48 34.08,27.2 34.08,30.8 33.6,31.28 33.6,31.44 IC-UC-1.17 | v34.4,25.44 34.08,21.92 v35.2,20.8
  Bottom 0.16: v34.4,25.44 v33.36,26.48 | v35.2,20.8 34.8,20.8 34.72,20.72 19.2,20.72 11.44,12.96 8.48,12.96 4.32,8.8 RS-UC-2.1
UC-RPI-RXI
  Top 0.2: RS-RPI-1.2B 18.2,46.17 18.2,46.06 18.2,45.11 19.16,45.11 IC-UC-1.45
UC-RPI-TXO
  Top 0.2: RS-RPI-1.1B 20.8,44.37 20.8,44.13 27.59,37.34 IC-UC-1.44
UC-RST#  (via drill 0.35)
  Top 0.2: IC-UC-1.40 28.28,39.53 v28.42,40.01
  Bottom 0.2: TN-UC-1.3 31.66,42.42 RU-UC-1.1 28.77,40.36 v28.42,40.01
UC-SRVO1
  Top 0.16: RS-SRVO-2.1B 36.72,38.72 36.32,38.72 35.92,38.32 34.88,38.32 34.32,37.76 IC-UC-1.30
UC-SRVO2
  Top 0.16: RS-SRVO-2.2B 36.16,39.28 35.76,39.28 35.12,38.64 34.48,38.64 33.92,38.08 IC-UC-1.31
UC-SRVO3
  Top 0.16: RS-SRVO-2.3B 35.6,39.84 35.12,39.84 33.76,38.48 33.6,38.48 IC-UC-1.32
UC-SRVO4
  Top 0.16: RS-SRVO-2.4B 35.04,40.4 34.8,40.4 33.2,38.8 IC-UC-1.33
UC-SRVO5
  Top 0.16: RS-SRVO-3.1B 34.08,41.6 34.08,40.32 32.88,39.12 IC-UC-1.34
UC-SRVO6
  Top 0.16: RS-SRVO-3.2B 33.52,41.68 32.96,41.12 32.96,40 32.48,39.52 IC-UC-1.35
UC-SRVO7
  Top 0.16: RS-SRVO-3.3B 32.96,42.72 32.96,42.24 32.4,41.68 32.4,40.08 32.16,39.84 IC-UC-1.36
UC-SRVO8
  Top 0.16: RS-SRVO-3.4B 32.32,43.28 29.52,43.28 28.88,43.92 27.92,43.92 27.2,43.2 27.2,42.24 29.12,40.32 29.6,40.32 30.08,39.84 IC-UC-1.37
UC-SRVO-PWR#  (via drill 0.25 pad 0.6)
  Top 0.16: v54.15,42.55 44.07,42.55 v41.67,40.16
  Top 0.19: 37.18,37.13 37.15,37.13
  Top 0.2: IC-UC-1.27 35.28,36.64 35.78,37.13 37.15,37.13 | v39.69,38.26 39.67,38.08 37.97,38.08 37.73,37.84 37.18,37.13
  Bottom 0.16: v54.15,42.55 63.76,51.84 66.48,51.84 RS-SRVO-1.1 | v41.67,40.16 39.68,38.32 39.68,38.16 v39.69,38.26
UC-UPDI
  Top 0.2: IC-UC-1.41 26.62,40.48 CON-UPDI.3
UC-VIN  (via drill 0.25 pad 0.6)
  Top 0.16: IC-UC-1.20 34.64,32.48 34.64,32.32 35.52,31.44 35.52,28 RD-IN-1.2 | v31.04,26.24 31.92,25.36 33.12,25.36 35.68,27.92 RD-IN-1.2 | RD-IN-1.2
  Bottom 0.16: v31.04,26.24 25.12,26.4 22.72,28.64 20.8,28.64 RU-IN-1.1
  other vias: 35.52,27.98
UC-VRPI  (via drill 0.25, 0.25 pad 0.6)  (1 unrouted)
  Top 0.16: 39.05,32.64 37.36,32.64 36.08,33.92 IC-UC-1.24 | v42.24,31.99 47.52,26.24 47.76,26.24 RU-RPI-2.1
  Top 0.2: RU-RPI-2.1 | 39.05,32.64 39.27,32.42 RD-RPI-2.2
  Bottom 0.16: v42.24,31.99 41.36,32.4 41.04,32.56 40.64,32.56 40.24,32.16
  Bottom 0.2: RD-RPI-2.2 40.18,32.1 40.24,32.16
  other vias: 47.79,26.19 39.65,32.1
UC-VSRVO  (via drill 0.25 pad 0.6)
  Top 0.16: 55.68,42.4 55.68,18.48 54.4,17.2 44.72,17.2 35.52,26.4 35.52,26.64 37.36,28.48 37.46,28.58 v37.46,29.85 RD-SRVO-2.2 37.52,30.08 37.52,30.58 36.83,31.27 36.83,31.68 IC-UC-1.22 | 55.6,42.48 RU-SRVO-2.1
  Top 0.2: 37.52,29.97 RD-SRVO-2.2 | 55.68,42.4 55.6,42.48
  Top 1: RD-SRVO-2.2 37.47,30
  Bottom 0.16: RD-SRVO-2.2 | RD-SRVO-2.2 v37.46,29.85
V485+  (via drill 0.5)
  Bottom 1: LF-485-1.2 arc90 CB-485-2.2 arc-90 CB-485-2.2 55.56,20.48 arc-90 56.04,20 56.04,14.92 | 56.04,14.92 IC-485-1.8 RU-485-1.2 | 56.04,14.92 arc90 55.09,13.97 CB-485-3.2
  other vias: 53.34,20.64
V485-  (via drill 0.35, 0.5)
  Bottom 1: LF-485-2.2 arc-90 CB-485-2.1 53.5,16.67 arc90 52.7,15.88 52.7,10.79 arc90 53.5,10 CB-485-3.1 55.09,7.94 arc90 55.72,7.3 IC-485-1.5 | 57.47,7.3 IC-485-1.5 | IC-485-1.5 62.07,7.3 | 62.07,7.3 64.77,7.3 69.85,2.22 76.36,2.22 76.04,2.54 76.04,7.94 | RS-485-2.1 76.04,7.94 | RS-485-3.1 76.04,7.94 | RD-485-1.1 62.07,7.3
  other vias: 53.34,18.41 76.04,11.27 52.7,1.11 52.55,13.97 56.52,22.07 74.14,22.07 84.3,19.68 84.3,0.95 76.83,6.35 76.99,14.61 70.33,17.46 69.22,7.62
  pour Top (isolate 0.3, rank 5): 52.23,0 52.23,21.91 53.98,22.38 86.52,22.38 88.42,20.48 88.42,-1.11 87.15,-2.38 55.24,-2.38 53.34,-0.48
  pour Bottom (isolate 0.3, rank 5): 52.23,22.54 52.23,0.64 86.2,0.64 86.2,22.07 53.02,22.54
VADC+  (via drill 0.35, 0.35 pad 0.75, 0.35 pad 0.8)
  Top 0.25: 34.95,37.01 IC-UC-1.28 34.31,36.35 34.29,36.04 v34.33,35.68
  Top 0.3: IC-UC-1.28 34.98,36.99 35.74,37.75 | IC-SRVO-1.8 v53.98,36.67 54.13,36.67
  Top 0.5: CB-IN-1.2 v11.12,24.49 | IC-SRVO-1.8 53.28,36.09 53.24,35.97 | CB-RPI-1.2 54.29,31.27 54.93,32.23 v54.93,33.5 v54.93,34.92 54.52,35.49 53.24,35.97 | 35.74,37.75 36.62,37.75 36.72,37.81 36.77,37.81 38.07,39.12 41.83,39.12 41.83,37.7 41.83,37.32 43.18,35.97 | 53.24,35.97 51.48,35.97 48.46,35.97 43.18,35.97 | v43.29,36.12 43.18,35.96 43.18,35.97
  Bottom 0.3: v54.93,34.92 IC-RPI-1.8
  Bottom 0.5: v11.12,24.49 arc90 10.16,23.54 IC-IN-1.8 10.21,22.27 10.21,21.52 12.73,19.48 17.18,19.48 18.97,21.27 34.01,21.27 42.77,29.88 43.09,30.22 43.13,30.5 v43.29,36.12 | v53.98,36.67 54.61,36.67 CB-SRVO-1.2
  pour Bottom (isolate 0.2, rank 2, no thermals): 32.86,34.13 34.77,34.92 35.24,35.56 35.4,35.88 34.77,36.51 33.81,35.56 32.7,35.72 31.91,35.08
VIN#
  Bottom 0.5: IC-IN-1.3 IC-IN-1.4 14.82,28 14.92,28.1 14.76,28.26 14.76,29.84 15.5,30.58 15.5,30.96 MOD-PWR.VIN+ 20.16,30.95 RU-IN-1.2
  pour Bottom (isolate 0.3, rank 2): 12.06,25.88 12.06,29.84 14.13,29.84 15.08,30.48 15.08,31.59 16.03,32.54 19.21,32.54 20.16,31.59 20.16,30.32 19.53,29.69 19.53,27.62 16.19,27.62 14.45,25.88
VIN+
  Bottom 0.5: IC-IN-1.2 IC-IN-1.1 8.84,28.16 8.84,27.1 8.2,26.46 CON-PWR.2
  pour Bottom (isolate 0.3): 0,23.02 0,29.69 2.22,30.64 7.78,30.64 8.89,29.84 11.75,29.84 11.75,26.04 9.53,26.04 8.26,24.77 8.26,23.97 7.3,23.02
VIN-
  Top 0.5: CON-PWR.1 15.93,19.26 17.62,20.95 MOD-PWR.VIN-
  pour Top (isolate 0.3): 0.16,23.02 8.26,23.02 9.21,22.86 14.13,22.86 14.76,23.81 14.76,26.51 15.56,27.46 19.53,27.46 20.32,26.67 20.32,19.37 17.14,15.4 10.16,14.76 10.16,14.13 9.68,13.81 0.16,13.81
VLCD#
  Bottom 0.5: CF-LCD-1.2 RD-LCD-1.2 13.33,10.16 RU-LCD-1.1 13.81,9.68 MOD-LCD-1.3
VLCD+
  Top 1: MOD-LCD-1.15 44.29,0.79 11.27,0.79 MOD-LCD-1.2
  Bottom 1: RU-LCD-1.2 arc-90 11.43,10.16 MOD-LCD-1.2 | MOD-LCD-1.15 44.45,10.16 CB-LCD-1.2 TP-LCD-1.3
VRPI#A
  Bottom 1: MOD-PWR.V5.2+ 55.15,29.05 IC-RPI-1.1
  pour Bottom (isolate 0.3, no thermals): 53.66,30.16 61.59,30.16 61.59,27.94 53.66,27.94
VRPI+  (via drill 0.5, 0.5 pad 0.8, 0.5 pad 1)
  Top 0.5: 21.91,53.98 20.64,55.24 10.96,55.24 CON-RPI.4 CON-RPI.2 6.71,53.77 6.67,53.82 6.51,53.66 6.51,49.37 v16.03,49.37 | 21.91,53.98 22.07,53.82 CP-RPI-1.+ | v20.32,49.37 21.27,50.32 21.27,53.34 21.91,53.98
  Top 1: LF-485-1.1 51.44,22.38 v49.69,28.42 | v48.11,34.45 v48.1,34.45 48.05,34.4 42.84,34.4 42.78,34.45 LF-UC-2.1
  Bottom 0.5: RU-RPI-2.2 v49.69,28.42 | IC-RPI-1.4 IC-RPI-1.3
  Bottom 1: CP-RPI-1.+ 33.81,53.82 48.26,53.02 v48.11,34.45 48.1,32.86 48.1,30.8 49.37,28.89 49.69,28.89 | 49.69,28.89 51.18,28.89 IC-RPI-1.4 | LF-UC-2.1 CB-UC-5.2 | LF-485-1.1 arc90 CB-485-1.2 46.35,20.48 arc90 45.72,19.84 RU-LCD-2.1 arc-90 RU-LCD-2.1 TP-LCD-1.2 arc90 TP-LCD-1.2 | v49.69,28.42 49.69,28.89 | v16.03,49.37 v20.32,49.37
  other vias: 40.64,34.45 51.44,20.64 21.75,55.24 26.51,52.55 26.51,55.24
  pour Top (isolate 0.3): 0,55.88 26.83,55.88 26.83,49.05 0,49.05
  pour Bottom (isolate 0.3, rank 2): 20.95,55.56 22.86,52.23 41.91,52.23 46.67,49.05 47.15,26.04 47.15,25.08 52.39,25.08 53.34,26.04 53.34,31.11 50.16,34.29 50.16,53.66 47.94,55.88 21.27,55.88
VRPI-  (via drill 0.5, 0.5 pad 1)
  Top 0.5: 4.47,9.97 v8.89,9.97 BTN-UC-1.4A BTN-UC-1.1A 18.32,10.08 19.04,10.08 25.44,16.48 v25.84,16.48 | 4.47,9.97 4.31,11.72 DL-UC-1.- | 4.47,9.97 4.47,8.92 DL-UC-2.- | v27.94,50.16 v51.28,49.85
  Top 1: LF-485-2.1 48.58,18.41 v48.58,21.91
  Bottom 0.5: CON-RPI.6 14.93,55.24 20.16,55.24 21.59,51.28 CP-RPI-1.- 23.29,51.23 CON-RPI.9 | RD-LCD-1.1 15.28,12.08 RD-LCD-1.1 | v25.84,16.48 25.84,15.28 RS-LCD-1.3A | 8.84,9.92 8.88,9.92 v8.89,9.97 | 46.98,9.68 46.88,9.68 CB-LCD-1.1 | v48.58,21.91 48.58,23.65 v56.67,23.65
  Bottom 1: CP-RPI-1.- 39.69,50.01 44.29,47.78 44.69,37.15 | 44.69,37.15 44.61,25.4 45.24,23.81 | 56.2,23.81 MOD-PWR.V5.2- | LF-UC-3.1 CB-UC-5.1 42.61,37.46 42.68,37.53 44.31,37.53 44.69,37.15 | LF-485-2.1 arc-90 CB-485-1.1 47.62,18.57 47.62,12.06 46.67,11.11 CB-LCD-1.1 | RD-LCD-1.1 8.89,12.06 8.84,9.92 MOD-LCD-1.1 8.73,1.43 24.13,1.59 | 46.99,10.16 46.98,9.68 MOD-LCD-1.16 46.83,1.43 31.75,1.59 | MOD-LCD-1.7 24.13,1.59 | MOD-LCD-1.8 26.67,1.59 | 26.67,1.59 24.13,1.59 | MOD-LCD-1.9 29.21,1.59 | 29.21,1.59 26.67,1.59 | MOD-LCD-1.10 31.75,1.59 | 31.75,1.59 29.21,1.59 | RD-LCD-1.1 CF-LCD-1.1
  other vias: 40.64,36.83 51.44,18.41 74.14,23.5 75.56,31.91 60.96,41.75 75.41,27.3 61.75,33.66 75.56,47.15 57.31,47.15 50.48,55.09 67.63,55.24 75.56,29.69 75.56,34.61 75.56,37.15 75.56,39.69 75.56,42.23 75.56,44.77 50.96,1.11 45.72,0.95 50.96,5.71 9.84,0.95 0.95,0.95 0.79,12.7 8.89,11.91 16.35,7.62 23.02,13.02 25.08,7.46 35.24,7.46 35.56,13.02 45.56,46.99 41.59,51.12
  pour Bottom (isolate 0.3, rank 6): -3.33,58.58 88.74,58.1 88.74,-1.75 86.2,-4.29 -0.95,-4.29 -3.81,-1.43 -3.81,58.26 -3.49,58.58
  pour Top (isolate 0.3, rank 6): -1.11,56.67 86.2,56.67 86.36,56.52 86.68,56.2 86.68,-0.64 85.57,-1.75 85.25,-1.75 0.16,-1.75 -1.91,0.32 -1.91,55.88
VSRVO#A+
  Top 1: MOD-PWR.V5.8+ 58.9,36.26 IC-SRVO-1.1
  pour Top (isolate 0.3, no thermals): 57.15,33.34 57.15,38.26 59.85,38.26 59.85,36.2 60.8,35.24 60.8,33.18 57.15,33.18
VSRVO#A-  (via drill 0.5)
  Bottom 1: MOD-PWR.V5.8- 63.98,31.59 66.67,34.29 66.67,44.13 75.88,53.34 82.39,53.34 CB-SRVO-2.1 CB-SRVO-2.1 arc-90 82.44,50.69 LF-SRVO-2.1
  other vias: 82.55,50.69
  pour Bottom (isolate 0.3, rank 2, no thermals): 56.36,32.7 56.36,30.32 64.93,30.32 68.1,33.5 68.1,43.34 74.3,49.53 86.52,49.53 87.31,50.32 87.31,56.2 86.52,56.99 86.52,57.15 77.95,56.99 65.09,44.13 65.09,34.29 63.5,32.7
VSRVO#B+  (via drill 0.5 pad 0.8)
  Top 0.5: RU-SRVO-2.2 58.42,41.59 v58.42,39.85
  other vias: 57.47,39.85 59.37,39.85
  pour Top (isolate 0.3, rank 2, no thermals): 57.15,38.73 60.01,38.73 60.01,41.43 58.58,43.5 57.15,43.5
  pour Bottom (isolate 0.3, no thermals): 57.31,40.96 60.01,40.96 60.01,36.04 56.99,36.04 56.99,40.8
VSRVO#C+  (via drill 0.5)
  Top 1: TP-SRVO-1.3 arc90 75.48,50.69 LF-SRVO-1.1
  Bottom 1: CB-SRVO-2.2 arc90 80.44,50.69 LF-SRVO-1.1
  other vias: 80.01,50.69
  pour Top (isolate 0.3, rank 2): 69.06,48.26 69.06,55.72 80.8,55.88 80.8,49.85 80.64,49.69 79.38,49.69 77.95,48.26
VSRVO+  (via drill 0.5)
  Bottom 0.5: RD-SRVO-1.1 79.85,23.02 CP-SRVO-1.+
  Bottom 1: CP-SRVO-1.+ 80.17,25.56 CB-SRVO-4.2 arc-90 80.17,26.2 CON-SRVO.2+ CON-SRVO.4+ CON-SRVO.5+ CON-SRVO.6+ CON-SRVO.8+ 80.17,48.1 arc-90 CB-SRVO-3.2 80.28,48.42 arc-90 LF-SRVO-1.2
  other vias: 80.01,48.69
  pour Top (isolate 0.3, no thermals): 78.9,48.74 81.28,48.74 81.28,22.07 78.9,22.07
  pour Bottom (isolate 0.3, no thermals): 78.74,49.21 81.44,49.21 81.44,25.24 80.64,24.92 80.64,22.7 79.69,22.7 78.9,23.81 78.9,49.05
VSRVO-  (via drill 0.5)
  Top 0.5: DL-SRVO-1.- 77,23.02 78.5,21.52 81.69,21.52 CP-SRVO-1.-
  Bottom 1: CP-SRVO-1.- 82.71,25.56 arc90 CB-SRVO-4.1 82.71,26.2 CON-SRVO.1- CON-SRVO.2- CON-SRVO.5- CON-SRVO.8- 82.71,48.42 CB-SRVO-3.1 arc90 82.55,48.58 LF-SRVO-2.2
  other vias: 82.55,48.69
  pour Top (isolate 0.3, rank 4, no thermals): 78.9,56.52 85.88,57.15 87.15,55.88 87.15,22.07 85.88,20.8 76.68,20.8 75.25,21.59 75.25,25.72 77.63,28.1 77.63,55.56
  pour Bottom (isolate 0.3, rank 3): 85.41,49.53 80.96,49.53 80.96,22.7 85.25,22.7 85.25,49.37
VUC+  (via drill 0.35, 0.35 pad 0.8)
  Top 0.25: IC-UC-1.42 29.05,37.34 29.05,37.31 v29.53,37.31
  Top 0.4: LF-UC-2.2 36.23,34.45 35.78,34.9 34.7,34.9 34.57,34.77 33.97,34.77 | v30.96,38.73 30.8,38.91 31.09,39.21 31.09,40.03 CON-UPDI.2 | v25.72,34.61 26.16,34.61 26.45,34.9 26.83,34.9 26.84,34.89 CB-UC-3.2
  Top 0.5: CB-UC-3.2 29.97,34.89 LF-UC-1.1 31.27,33.34 v31.27,31.11 31.11,32.16 31.76,32.65 32.17,32.65 34.29,34.61 33.97,34.77 30.64,38.1 v30.96,38.73 v29.53,37.31 29.65,37.18 CB-UC-3.2
  Bottom 0.25: CB-UC-1.2 31.55,30.99 v31.27,31.11 | CB-UC-2.2 29.53,37.7 v29.53,37.31 | RU-UC-1.2 31.11,38.66 31.11,38.73 v30.96,38.73
  Bottom 0.5: MOD-IMU-1.VCC 25.08,33.81 25.72,34.45 v25.72,34.61
  Bottom 1: CB-UC-6.2 LF-UC-2.2
  other vias: 29.65,34.89 31.4,33.46 38.74,34.45
  pour Top (isolate 0.2, rank 3, no thermals): 25.08,34.92 30.16,40.01 26.99,42.86 28.42,43.97 32.7,42.86 32.07,39.85 36.51,35.56 37.31,35.24 39.37,35.24 39.37,33.66 36.04,33.66 31.43,28.89 31.11,28.89
VUC-  (via drill 0.35, 0.35 pad 0.6, 0.35 pad 0.7, 0.35 pad 0.75, 0.35 pad 0.8)
  Top 0.2: CF-IN-1.1 | CF-IN-1.1 | 36.96,26.64 CF-IN-1.1
  Top 0.25: IC-UC-1.15 32.23,31.34 v32.07,31.75 | IC-UC-1.29 34.08,36.83 33.86,36.67 33.82,36.63 33.69,36.63 v33.3,36.71 | IC-UC-1.43 28.7,36.99 28.73,36.83 v28.73,36.51
  Top 0.5: CB-IN-1.1 v13.02,24.49 | CF-RPI-2.1 41.27,31.84 41.43,32.93 51.03,32.93 CF-RPI-1.1 CB-RPI-1.1 | v54.13,40.48 IC-SRVO-1.5
  Bottom 0.5: CF-IN-2.1 15.98,22.8 IC-IN-1.5 13.97,23.54 arc90 v13.02,24.49 | CON-UPDI.1 31.21,43.5 34.31,43.5 37.86,39.96 37.86,37.55 LF-UC-3.2 38.1,37.31 36.67,37.31 | 36.67,37.31 34.73,37.31 34.6,37.18 CB-UC-4.1 31.79,37.18 CB-UC-3.1 29.85,36.23 29.73,36.35 28.18,36.35 CB-UC-2.1 | MOD-IMU-1.COM 4.76,36.35 6.61,34.5 24.18,34.5 26.19,36.51 | 26.19,36.51 v28.73,36.51 | CB-UC-1.1 32.9,31.79 36.67,35.56 36.67,37.31 | CB-UC-1.1 32.76,31.63 31.1,32.01 30.53,32.01 26.19,36.51 | CB-UC-1.1 33.22,28.86 35.68,24.97 | CF-RPI-1.1 51.12,33.34 51.28,33.34 IC-RPI-1.5 51.28,35.41 54.58,38.72 | 54.58,38.72 54.75,38.72 CB-SRVO-1.1 | 54.58,38.72 54.58,38.76 CF-SRVO-1.1 v54.13,40.48
  Bottom 1: CF-IN-2.1 33.41,22.86 35.68,24.97 CF-IN-1.1 CF-SRVO-2.1 CF-RPI-2.1 | LF-UC-3.2 CB-UC-6.1
  other vias: 36.87,26.63 38.74,36.83 50.96,33.5 38.77,28.54 0.95,47.94 0.79,31.27 10,47.94 23.97,39.05 24.92,41.91 24.13,48.1 41.12,46.99 39.21,40.01 31.91,44.45 23.34,35.08 7.14,39.21 6.51,34.77 23.34,22.7 32.23,27.62 33.02,23.97 28.1,22.54 35.24,24.77 11.75,31.11 34.77,30.16 30.16,22.54 23.5,31.91 40.99,30.76
  pour Bottom (isolate 0.2, rank 3, no thermals): 0,29.53 0,48.42 10.16,48.42 13.18,45.88 21.43,45.88 24.29,48.9 29.05,48.9 36.83,48.26 41.91,47.31 42.55,46.51 43.02,43.81 43.02,39.37 43.18,32.23 39.05,27.78 33.5,22.23 7.78,22.23
  pour Top (isolate 0.3, rank 4): -0.79,48.26 -0.48,48.74 36.04,48.74 41.59,47.15 42.55,43.5 52.07,43.66 55.56,43.66 55.56,18.57 51.12,13.97 48.58,11.43 40.64,11.43 38.1,13.97 29.69,13.97 26.19,17.46 24.61,17.46 21.27,14.13 -0.79,14.13 -1.43,18.41 -1.43,47.62

### Text on the board
tValues: GREEN | GREEN | BLUE
tDocu: Orso Eric 2021-08 | OrangeHat